# EAGLE design MicroSD_Sniffer (EAGLE 6.6.0)
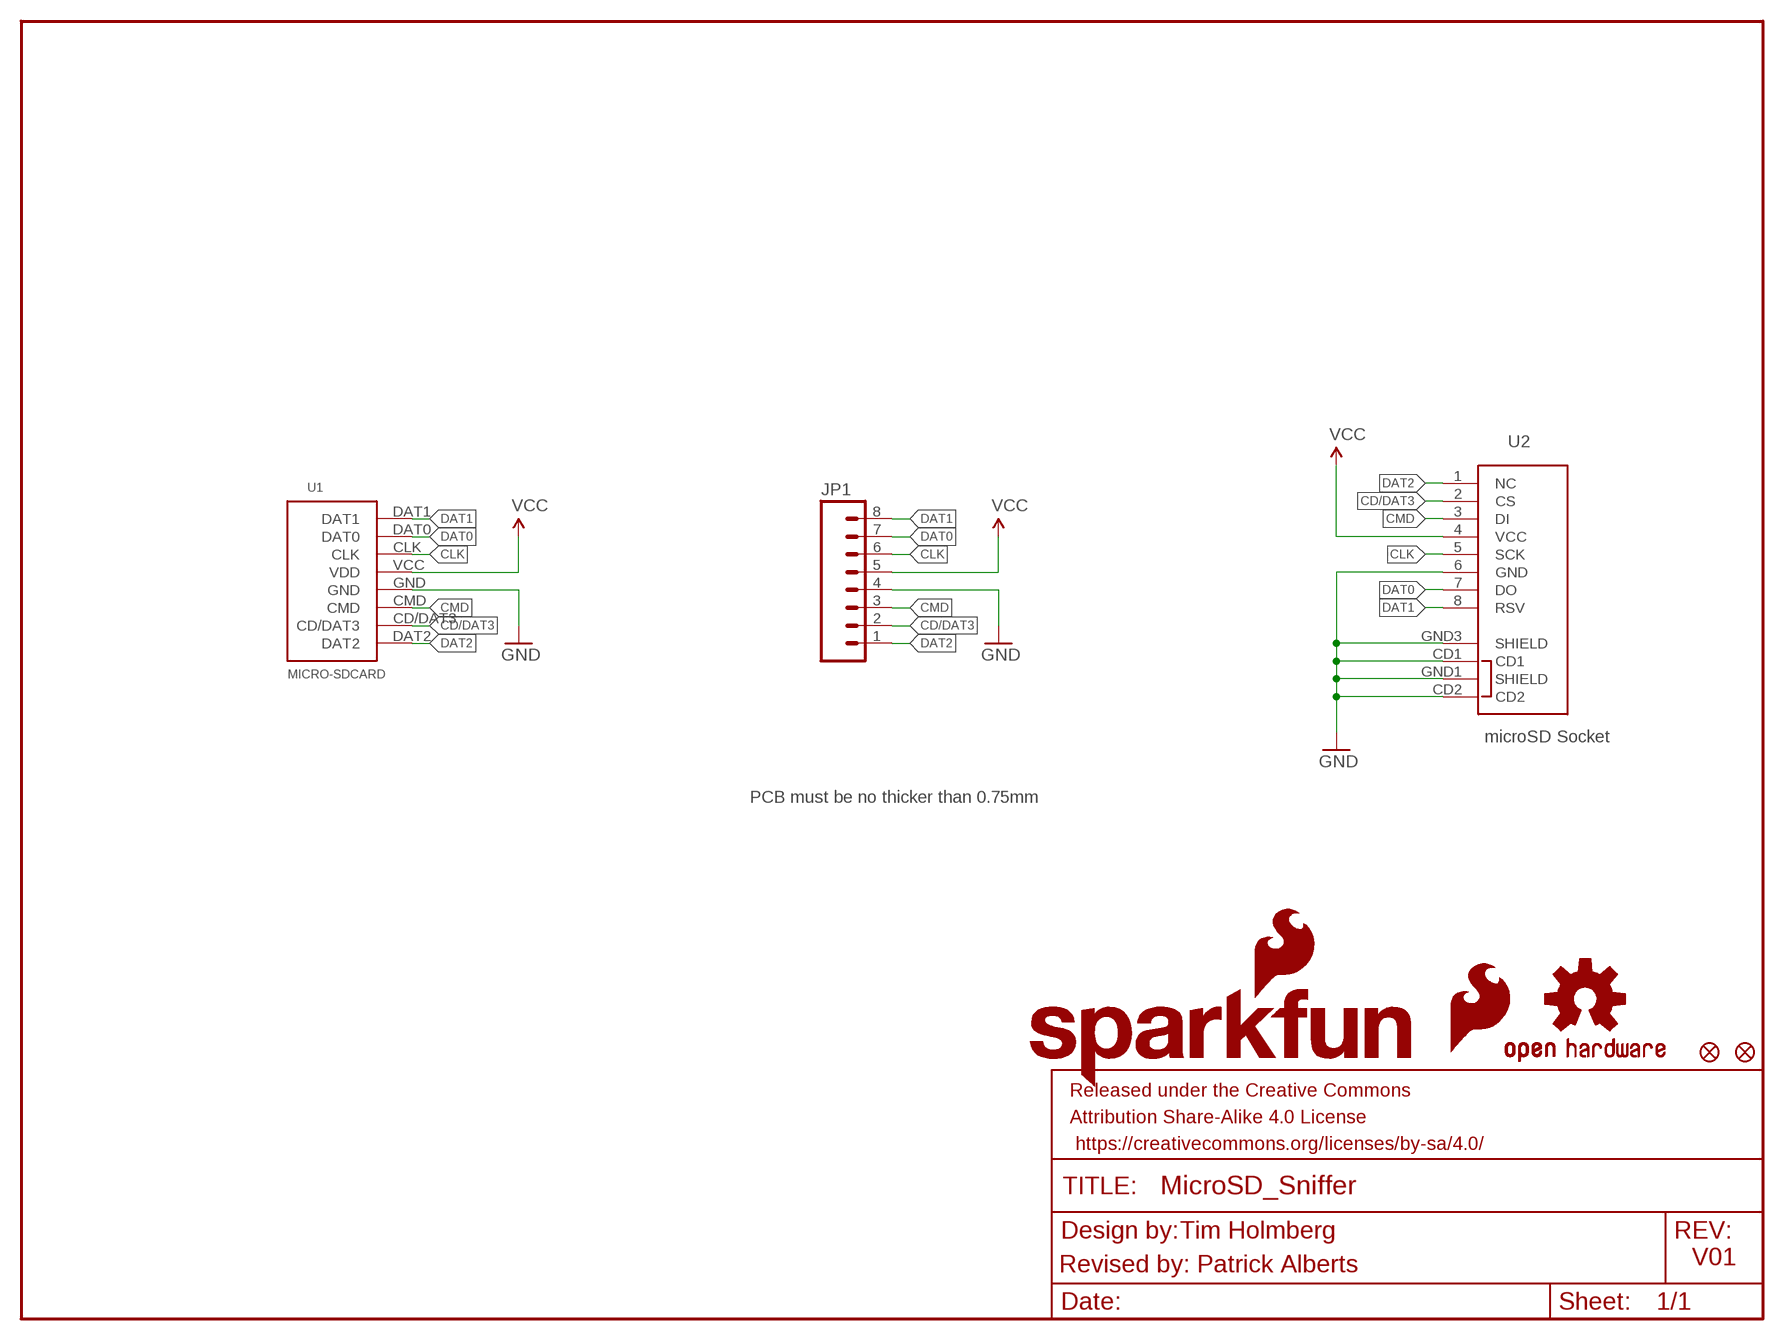
[diagram p0: schematic, sheet 1]

## Parts
FID1  FIDUCIAL1X2  [FIDUCIAL-1X2]
FID2  FIDUCIAL1X2  [FIDUCIAL-1X2]
FRAME1  FRAME-LETTER  [CREATIVE_COMMONS]
JP1  M08  [1X08]
LOGO1  OSHW-LOGOM  [OSHW-LOGO-M]
LOGO2  SFE_LOGO_FLAME.2_INCH  [SFE_LOGO_FLAME_.2]
LOGO3  SFE_LOGO_NAME_FLAME.1_INCH  [SFE_LOGO_NAME_FLAME_.1]
U1  MICRO-SDCARD  [MICRO-SDCARD]
U2  microSD Socket  USD-SOCKET  [MICROSD_1:1]

## Nets
CD/DAT3: JP1.2 U1.CD/DAT3 U2.2(CS)
CLK: JP1.6 U1.CLK U2.5(SCK)
CMD: JP1.3 U1.CMD U2.3(DI)
DAT0: JP1.7 U1.DAT0 U2.7(DO)
DAT1: JP1.8 U1.DAT1 U2.8(RSV)
DAT2: JP1.1 U1.DAT2 U2.1(NC)
GND: JP1.4 U1.GND U2.6(GND) U2.CD1 U2.CD2 U2.GND1(SHIELD) U2.GND3(SHIELD)
VCC: JP1.5 U1.VCC(VDD) U2.4(VCC)

## Notes on the sheet
- PCB must be no thicker than 0.75mm
- Tim Holmberg
- V01
- Revised by: Patrick Alberts

## Library data of the parts
FID1 FID2 = SparkFun-Aesthetics:FIDUCIAL: Fiducial Alignment Points Various fiducial points for machine vision alignment.
FRAME1 = SparkFun-Aesthetics:FRAME-LETTER: Schematic Frame Standard 8.5x11 US Letter frame; DESIGNER: NAME; VERSION: v01
JP1 = SparkFun:M08: Header 8 Standard 8-pin 0.1" header. Use with straight break away headers (SKU : PRT-00116), right angle break away headers (PRT-00553), swiss pins (PRT-00743), machine pins (PRT-00117), and female headers (PRT-00115).
LOGO1 = SparkFun-Aesthetics:OSHW-LOGO: Open Source Hardware Logo This logo indicates the piece of hardware it is found on incorporates a OSHW license and/or adheres to the definition of open source hardware found here: http://freedomdefined.org/OSHW
LOGO2 = SparkFun-Aesthetics:SFE_LOGO_FLAME: SFE Logo, flame only This is the SparkFun flame logo. The logo on the schematic will always be the same size; the package variant is the height of the flame. Default layer for the logo on the board is tSilk.
LOGO3 = SparkFun-Aesthetics:SFE_LOGO_NAME_FLAME: SFE Logo, name and flame This is the SparkFun full logo. The logo on the schematic will always be the same size; the package variant is the height of the flame part of the logo. Default layer for the logo on the board is tSilk.
U1 = SparkFun-Boards:MICRO-SDCARD: MicroSD footprint- NOT a socket for a MicroSD card!
U2 = SparkFun-Connectors:USD-SOCKET: microSD Socket Push-push type uSD socket. Schematic element and footprint production proven. Spark Fun Electronics SKU : PRT-00127. tDoc lines correctly indicate media card edge positions when inserting (unlocked, locked, depressed). NOTE: CD1 and CD2 are connected internally; PROD_ID: CONN-07820

## Board
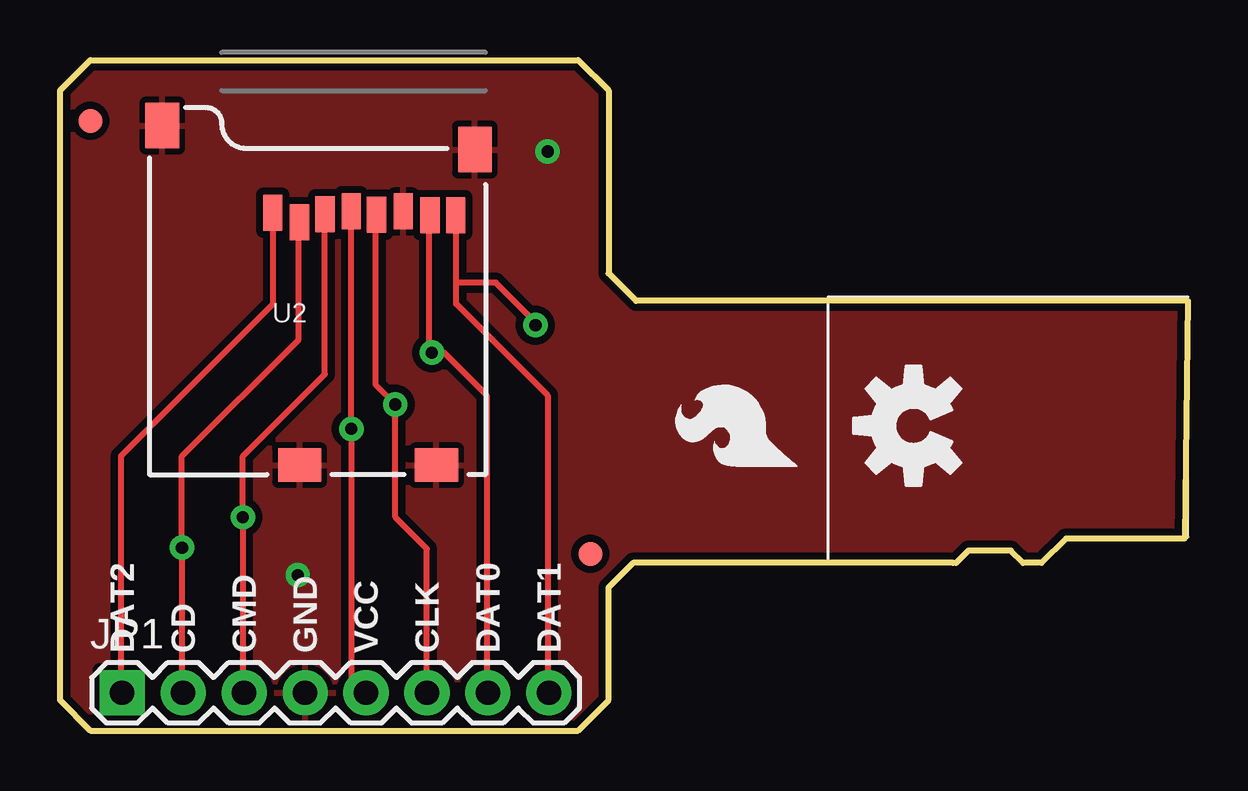
[diagram p1: board, top side]
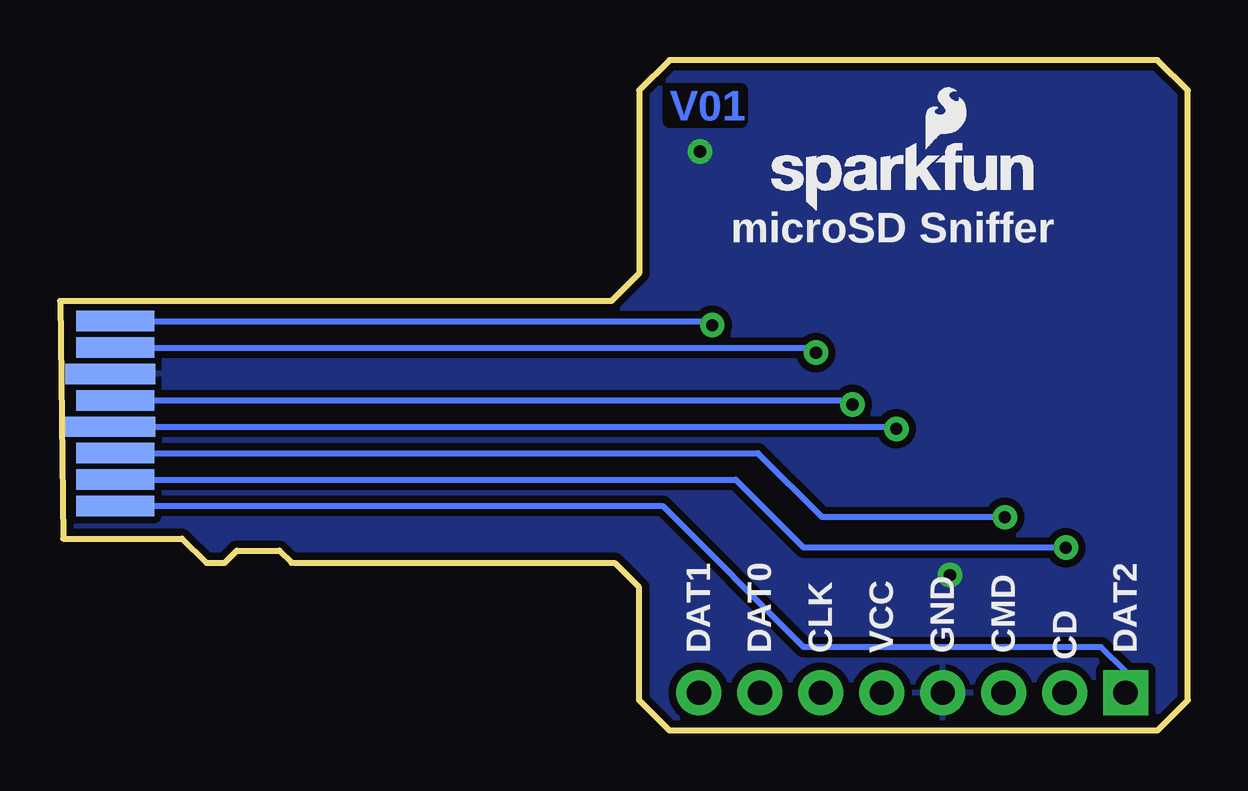
[diagram p2: board, bottom side, seen from below]

Size 46.99 x 27.94 mm. Coordinates in mm from the lower left corner, seen from the top.
Outline: 37.34,6.99 37.85,7.49 39.62,7.49 40.13,6.99 40.89,6.99 41.91,8 46.86,8 46.99,17.91 24,17.91 22.86,19.05 22.86,26.67 21.59,27.94 1.27,27.94 0,26.67 0,1.27 1.27,0 21.59,0 22.86,1.27 22.86,5.97 23.88,6.99 37.21,6.99
Copper layers (1*16): Top 0.035mm / dielectric 1.5mm / Bottom 0.035mm
Design rules "SparkFun-2-layer": minimum track width 7mil, minimum drill 15mil, track to track 8mil, track to pad 8mil, pad to pad 8mil, via to via 8mil, smd to smd 8mil, copper to edge 8mil, drill to drill 8mil, minimum pad ring 12mil, minimum via ring 10mil, stop-mask expansion 4mil, vias tented up to drill 20mil, thermal gap 10mil

### Footprints (pad centres in the part's own frame; a part is rotated, then mirrored left to right if it is on the bottom)
FIDUCIAL-1X2 = smd 1 x 1: 1 0,0
1X08 = drill 1.016 pad 1.88 square: 1 0,0 | drill 1.016 pad 1.88: 2 2.54,0; 3 5.08,0; 4 7.62,0; 5 10.16,0; 6 12.7,0; 7 15.24,0; 8 17.78,0
MICRO-SDCARD = smd 0.85 x 3.25 bottom: CD/DAT3 2.56,2.3; CLK 5.86,2.3; CMD 3.66,2.3; DAT0 8.06,2.3; DAT1 9.16,2.3; DAT2 1.46,2.3 | smd 0.85 x 3.75 bottom: GND 6.96,2.1; VCC 4.76,2.1
MICROSD_1:1 = smd 0.8 x 1.5: 1 5.096,10.919; 2 6.218,10.519; 3 7.274,10.853; 4 8.367,10.982; 5 9.421,10.828; 6 10.539,10.973; 7 11.648,10.819; 8 12.721,10.819 | smd 1.8 x 1.4: CD1 11.92,0.4; CD2 6.22,0.4 | smd 1.4 x 1.9: GND1 0.497,14.55; GND3 13.52,13.55

### Placement (x,y rotation side)
FID1  1.27,25.4 0 top
FID2  22.1,7.37 0 top
FRAME1  -6.84,-13.97 0 top  (outside the outline)
JP1  2.59,1.57 0 top
LOGO1  35.56,12.7 90 top
LOGO2  30.99,10.67 90 top
LOGO3  17.78,21.59 0 bottom
U1  46.99,7.9 90 top
U2  3.76,10.66 0 top

### Tracks (layer width: path | path; a pad name or v marks a point on that pad's centre or on a via)
CD/DAT3  (via drill 0.51)
  Top 0.254: JP1.2 5.08,1.63 v5.08,7.62 5.08,11.43 9.94,16.29 9.94,21.14 U2.2
  Bottom 0.254: v5.08,7.62 16,7.62 18.84,10.46 U1.CD/DAT3
CLK  (via drill 0.51)
  Top 0.254: v13.97,13.59 13.97,8.89 15.29,7.57 JP1.6 | v13.97,13.59 13.97,13.97 | v13.97,13.59 13.16,14.39 13.16,21.47 U2.5
  Bottom 0.254: v13.97,13.59 13.99,13.61 | 14.08,13.48 v13.97,13.59 | U1.CLK 14.14,13.76 v13.97,13.59
CMD  (via drill 0.51)
  Top 0.254: JP1.3 7.62,1.63 v7.62,8.89 7.62,11.43 11.04,14.85 U2.3
  Bottom 0.254: v7.62,8.89 15.24,8.89 17.91,11.56 U1.CMD
DAT0  (via drill 0.51)
  Top 0.254: v15.49,15.75 15.44,15.8 | v15.49,15.75 16,15.75 17.78,13.97 17.78,1.63 JP1.7 | v15.49,15.75 15.39,15.85 15.39,21.46 U2.7
  Bottom 0.254: v15.49,15.75 15.55,15.81 | 15.56,15.68 v15.49,15.75 | U1.DAT0 15.71,15.96 v15.49,15.75
DAT1  (via drill 0.51)
  Top 0.254: JP1.8 20.32,1.63 20.32,13.97 16.51,17.78 16.51,18.67 | 16.51,18.67 16.51,21.45 U2.8 | v19.81,16.89 19.81,17.02 18.16,18.67 16.51,18.67
  Bottom 0.254: 19.83,16.91 v19.81,16.89 19.98,17.06 U1.DAT1
DAT2
  Top 0.254: JP1.1 2.54,1.63 2.54,11.43 8.89,17.78 8.89,21.55 U2.1
  Bottom 0.254: JP1.1 2.59,2.46 3.61,3.48 16,3.48 21.88,9.36 U1.DAT2
GND  (via drill 0.51)
  other vias: 20.32,24.13 9.91,6.48
  pour Top (isolate 0.305): 23.88,6.99 22.86,5.97 22.86,1.27 21.59,0 1.27,0 0,1.27 0,26.67 1.27,27.94 21.59,27.94 22.86,26.67 22.86,19.05 24,17.91 46.99,17.91 46.99,8 41.78,8 40.89,7.11 40.01,7.11 39.5,7.62 37.97,7.62 37.34,6.99
  pour Bottom (isolate 0.305): 46.99,17.91 24,17.91 22.86,19.05 22.86,26.67 21.59,27.94 1.27,27.94 0,26.67 0,1.27 1.27,0 21.59,0 22.86,1.27 22.86,5.97 22.99,6.1 23.97,6.99 37.47,6.99 37.85,7.37 39.37,7.37 40.01,6.99 41.02,6.99 41.91,7.87 46.86,8
VCC  (via drill 0.51)
  Top 0.254: 12.19,2.13 JP1.5 12.14,2.19 v12.14,12.57 U2.4
  Bottom 0.254: 12.21,12.51 v12.14,12.57 12.23,12.66 U1.VCC

### Text on the board
Bottom: V01
tPlace: DAT2 | CD | CMD | GND | VCC | CLK | DAT0 | DAT1
bPlace: microSD Sniffer | CD | DAT2 | CMD | GND | VCC | CLK | DAT0 | DAT1
tDocu: PCB must be no thicker than 0.75mm | Tim Holmberg | Revised by: Patrick Alberts